# Altium schematic sheet LNA_and_antenna.SchDoc
size A
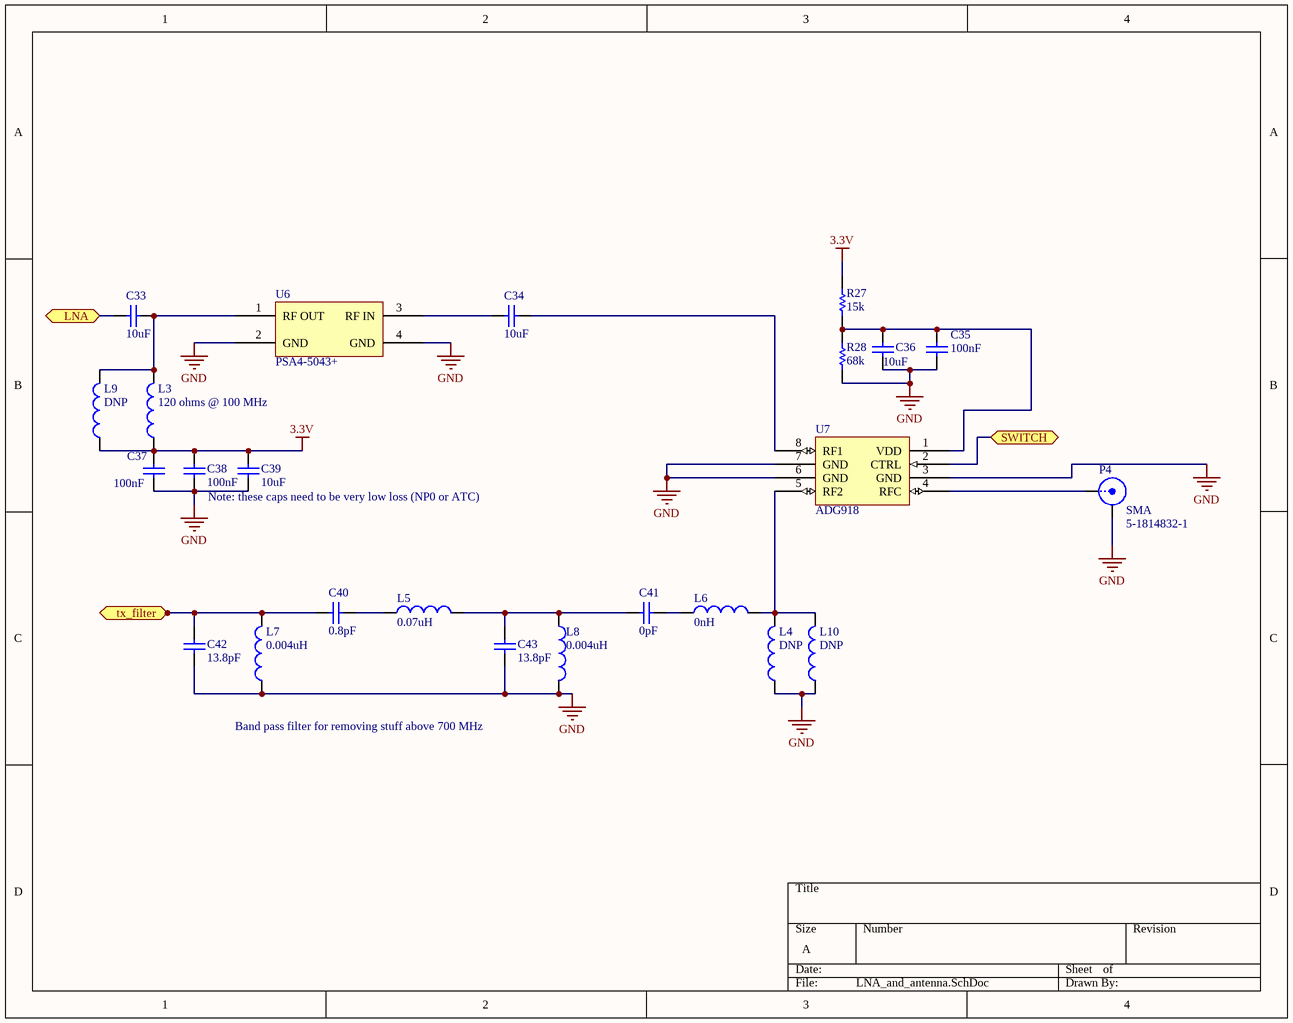
[diagram p0: LNA_and_antenna.SchDoc]

## Parts
C33  value 10uF  [0402]  (hidden comment: Cap Semi)
C34  value 10uF  [0402]  (hidden comment: Cap Semi)
C35  value 100nF  [0402]  (hidden comment: Cap Semi)
C36  value 10uF  [0402]  (hidden comment: Cap Semi)
C37  value 100nF  [0402]  (hidden comment: Cap Semi)
C38  value 100nF  [0402]  (hidden comment: Cap Semi)
C39  value 10uF  [0402]  (hidden comment: Cap Semi)
C40  value 0.8pF  [0402]  (hidden comment: Cap Semi)
C41  value 0pF  [0402]  (hidden comment: Cap Semi)
C42  value 13.8pF  [0402]  (hidden comment: Cap Semi)
C43  value 13.8pF  [0402]  (hidden comment: Cap Semi)
L3  value 120 ohms @ 100 MHz  [0402]  (hidden comment: Inductor)
L4  value DNP  [0402]  (hidden comment: Inductor)
L5  value 0.07uH  [0402]  (hidden comment: Inductor)
L6  value 0nH  [0402]  (hidden comment: Inductor)
L7  value 0.004uH  [0402]  (hidden comment: Inductor)
L8  value 0.004uH  [0402]  (hidden comment: Inductor)
L9  value DNP  [0402]  (hidden comment: Inductor)
L10  value DNP  [0402]  (hidden comment: Inductor)
P4  SMA  [SMB_V-RJ45]
R27  value 15k  [0402]  (hidden comment: Res Semi)
R28  value 68k  [0402]  (hidden comment: Res Semi)
U6  PSA4-5043+
U7  ADG918  [ADG918]

## Ports
LNA, SWITCH, tx_filter

## Nets
3.3V: C37.1 C38.1 C39.1 L3.1 L9.1 R27.1
GND: C35.1 C36.1 C37.2 C38.2 C39.2 C42.2 C43.2 L4.1 L7.1 L8.2 L10.1 P4.2(Y) R28.2 U6.2(GND) U6.4(GND) U7.3(GND) U7.6(GND) U7.7(GND)
LNA: C33.2 ; port LNA
SWITCH: U7.2(CTRL) ; port SWITCH
tx_filter: C40.2 C42.1 L7.2 ; port tx_filter
NetC33_1: C33.1 L3.2 L9.2 U6.1(RF_OUT)
NetC34_1: C34.1 U7.8(RF1)
NetC34_2: C34.2 U6.3(RF_IN)
NetC35_2: C35.2 C36.2 R27.2 R28.1 U7.1(VDD)
NetC40_1: C40.1 L5.1
NetC41_1: C41.1 L6.1
NetC41_2: C41.2 C43.1 L5.2 L8.1
NetL4_2: L4.2 L6.2 L10.2 U7.5(RF2)
NetP4_1: P4.1(X) U7.4(RFC)

## Notes on the sheet
- Note: these caps need to be very low loss (NP0 or ATC)
- (near P4) 5-1814832-1
- Band pass filter for removing stuff above 700 MHz

## Library data of the parts
C33-C43 = Cap Semi: Capacitor (Semiconductor SIM Model); Published: 8-Jun-2000; LatestRevisionDate: 29-May-2009; LatestRevisionNote: IPC-7351 Footprint Added.; PackageReference: C1206; Publisher: Altium Limited; PackageDescription: Chip Capacitor
L3-L10 = Inductor: Code_IEC: 1005; Published: 8-Jun-2000; LatestRevisionDate: 29-May-2009; LatestRevisionNote: IPC-7351 Footprint Added.; PackageReference: 0402-A; Publisher: Altium Limited; PackageDescription: Chip Inductor; Code_JEITA: 0402
P4 = SMB: SMB Straight Connector; LatestRevisionDate: 17-Jul-2002; LatestRevisionNote: Re-released for DXP Platform.; Publisher: Altium Limited
R27 R28 = Res Semi: Semiconductor Resistor; Published: 8-Jun-2000; LatestRevisionDate: 17-Jul-2002; LatestRevisionNote: Re-released for DXP Platform.; PackageReference: AXIAL-0.5; Publisher: Altium Limited; PackageDescription: Axial Device, Thru-Hole; 2 Leads; 0.5 in Pin Spacing
U6 = PSA4-5043+: LNA
U7 = ADG918: RF Switch; Manufacturer: Analog Devices Inc; Manufacturer Part Number: ADG918BRMZ; Description: IC SW ONE HS SPDT 1.6/2.7V 8MSOP; RF Type: General Purpose; Frequency: 0Hz ~ 2GHz; ComponentLink1URL: http://www.analog.com/static/imported-files/data_sheets/ADG918_919.pdf; ComponentLink1Description: Datasheet for ADG918; Supplier 1: Digi-Key; RoHS: RoHS Compliant; Category: RF/IF and RFID; Stock 1: 5696; Pricing 1: 1=2.75, 10=2.453, 25=2.2072, 100=2.0111, 250=1.81484, 500=1.62846, 1000=1.3734, 2500=1.308 (USD); Features: SPDT; Package / Case: 8-TSSOP, 8-MSOP (0.118", 3.00mm Width); Supplier Device Package: 8-MSOP; Packaging: Tube; Supplier Part Number 1: ADG918BRMZ-ND